# Altium schematic sheet Power_supply.SchDoc
size A; SheetNumber: 4; SheetTotal: 10
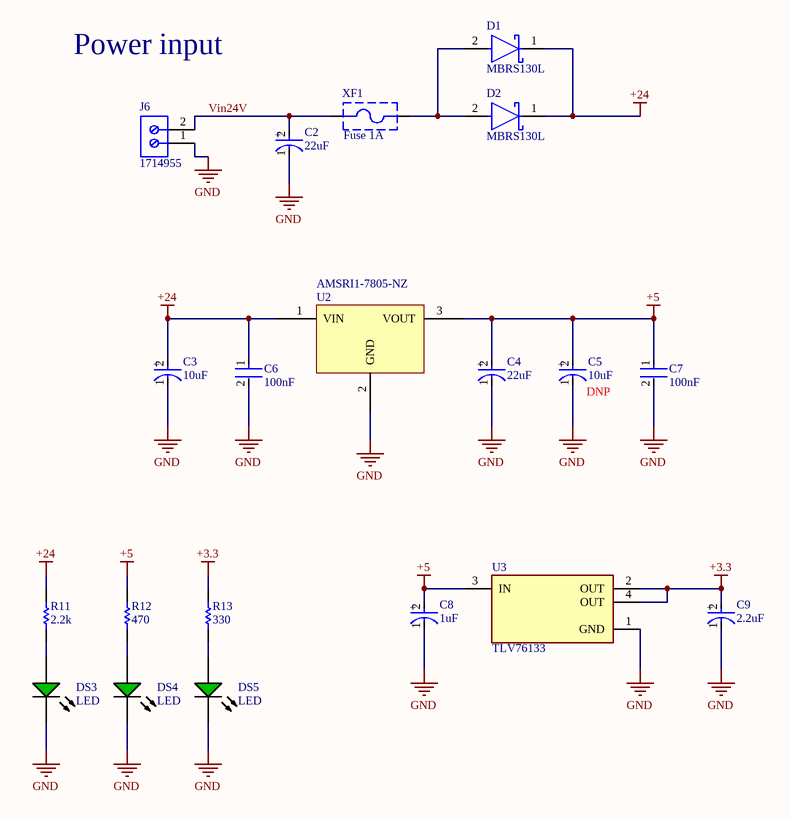
[diagram p0: Power_supply.SchDoc]

## Parts
C2  22uF  [FP-FCE-MFG]
C3  10uF  [FP-FKD-MFG]
C4  22uF  [FP-FCE-MFG]
C5  10uF  [FP-FKD-MFG]
C6  100nF  [FP-0805-L_2_01_0_2-W_1_25-IPC_B]
C7  100nF  [FP-0805-L_2_01_0_2-W_1_25-IPC_B]
C8  1uF  [FP-FKD-MFG]
C9  2.2uF  [FP-FKD-MFG]
D1  MBRS130L  [FP-403AF-MFG]
D2  MBRS130L  [FP-403AF-MFG]
DS3  LED  [AVAG-HSMX-C170_V]
DS4  LED  [AVAG-HSMX-C170_V]
DS5  LED  [AVAG-HSMX-C170_V]
J6  1714955  [PHOE-1714955_V]
R11  2.2k  [RESC2013X50X30LL20T20]
R12  470  [RESC2013X50X30LL20T20]
R13  330  [RESC2013X50X30LL20T20]
U2  AMSRI1-7805-NZ  [SIP750W46P254L1400H1010Q3]
U3  TLV76133  [FP-DCY0004A-MFG]
XF1  Fuse 1A  [696106003002]

## Nets
+3.3: C9.2(A) R13.2 U3.2(OUT) U3.4(OUT)
+5: C4.2(A) C5.2(A) C7.1 C8.2(A) R12.2 U2.3(VOUT) U3.3(IN)
+24: C3.2(A) C6.1 D1.1(C) D2.1(C) R11.2 U2.1(VIN)
GND: C2.1(C) C3.1(C) C4.1(C) C5.1(C) C6.2 C7.2 C8.1(C) C9.1(C) DS3.2(K) DS4.2(K) DS5.2(K) J6.1 U2.2(GND) U3.1(GND)
Vin24V: C2.2(A) J6.2 XF1.1
NetD1_2: D1.2(A) D2.2(A) XF1.2
NetDS3_1: DS3.1(A) R11.1
NetDS4_1: DS4.1(A) R12.1
NetDS5_1: DS5.1(A) R13.1

## Notes on the sheet
- Power input
- (near C5) DNP
- (in symbol CMP-2000-06207-2) +
- (in symbol CMP-05427-002128-1) +

## Library data of the parts
C2 C4 = CMP-05427-002128-1: CAP ALUM 22UF 20% 50V SMD; Ripple Current: 120mA; Material: Aluminium; ESR (Equivalent Series Resistance): 700mR; Polarity: Polar; Lead Length: 3.4mm; Leakage Current: 3uA; Life (Hours): 1000Hour; Diameter: 8mm; RoHS Compliant: Yes; Voltage Rating: 50V; Reach SVHC Compliant: Yes; Series: FC; Capacitance: 22uF; Ripple Current (AC): 120mA; Mount: Surface Mount; Min Operating Temperature: -40°C; Max Operating Temperature: 105°C; Radiation Hardening: No; Contact Plating: Tin; Impedance: 700mR; Construction: Cylindrical; Height - Seated (Max): 0.244inch; Packaging: Tape and Reel; Dielectric Material: Aluminium; Voltage: 50V; Voltage Rating (DC): 50V; Height: 6.2mm; Package Quantity: 1000; Length: 6.5mm; Lead Pitch: 2.2mm; Width: 8.3mm; Termination: SMD/SMT; Case/Package: Radial; Tolerance: 20%; Number of Pins: 2; Lead Free: Lead Free
C3 C5 C8 C9 = CMP-2000-06207-2: CAP ALUM 10UF 20% 50V SMD; Impedance: 880mR; Ripple Current: 165mA; Polarity: Polar; Leakage Current: 3uA; Lead Diameter: 0.65mm; Life (Hours): 2000Hour; REACH SVHC: No SVHC; Series: FK; Max Operating Temperature: 105°C; Radiation Hardening: No; Size: 5.8mm; Ripple Current (AC): 165mA; Lead Free: Lead Free; Voltage: 50V; Contact Plating: Tin; Case/Package: Radial; RoHS Compliant: Yes; Voltage Rating: 50V; Height - Seated (Max): 0.24inch; Package Quantity: 1000; Termination: SMD/SMT; Number of Pins: 2; Mount: Surface Mount; Packaging: Tape and Reel; Length: 5.8mm; Width: 7.8mm; Min Operating Temperature: -55°C; Height: 5.8mm; ESR (Equivalent Series Resistance): 880mR; Capacitance: 10uF; Diameter: 6.3mm; Voltage Rating (DC): 50V; Construction: Cylindrical; Tolerance: 20%; Lead Pitch: 1.8mm
C6 C7 = CMP-2007-04174-2: General Purpose Ceramic Capacitor, 0805, 10nF, 10%, X7R, 15%, 100V; Packaging: Tape and Reel; Min Operating Temperature: -55°C; Dielectric Material: Ceramic; Height: 1.4mm; Voltage Rating: 100V; Termination: SMD/SMT; Case Code (Imperial): 0805; Case Code (Metric): 2012; Case/Package: 0805; Construction: Flat; Radiation Hardening: No; Series: -; Dielectric: X7R; Package Quantity: 2000; Mount: Surface Mount; Capacitance: 100nF; Contact Plating: Tin; Voltage: 100V; Lead Free: Lead Free; Depth: 1.25mm; RoHS Compliant: Yes; Number of Pins: 2; Max Operating Temperature: 125°C; Length: 2.01mm; Voltage Rating (DC): 100V; Thickness: 0.055inch; REACH SVHC: No SVHC; Width: 0.049inch; Tolerance: 10%
D1 D2 = CMP-00278-20916186-1: MBRS130L Rectifier Diode, Schottky, 1 Phase, 1 Element, 2A, 30V V(RRM), Silicon, DO-214AA; Manufacturer Lifecycle Status: OBSOLETE; Output Current: 1A; Forward Voltage: 445mV; Peak Reverse Current: 1mA; Max Surge Current: 40A; Polarity: Standard; Element Configuration: Single; Max Junction Temperature (Tj): 125°C; Lead Free: Lead Free; Packaging: Cut Tape; Mount: Surface Mount; Max Repetitive Reverse Voltage (Vrrm): 30V; Forward Current: 2A; Length: 4.75mm; Weight: 180mg; Radiation Hardening: No; Max Operating Temperature: 125°C; Schedule B: 8541100080; Peak Non-Repetitive Surge Current: 40A; Height: 2.45mm; Case/Package: SMB; Min Operating Temperature: -65°C; Average Rectified Current: 2A; Lifecycle Status: Obsolete; REACH SVHC: No SVHC; Voltage Rating (DC): 30V; Max Forward Surge Current (Ifsm): 40A; NexarPartId: 20916186; Max Reverse Leakage Current: 1mA; Number of Pins: 2; Width: 3.95mm; RoHS: Compliant; Max Reverse Voltage (DC): 30V; Current Rating: 1A
DS3-DS5 = CMP-2000-05062-1: Chip LED, Green, 2.2 V, -40 to 85 degC, 2-Pin SMD, Pb-Free, Tape and Reel; Manufacturer: Avago; No. of Pins: 2; Peak Wavelength: 570nm; SVHC: NoSVHC(16-Jun-2014); Dominant Wavelength: 572nm; Forward Current If: 20mA; Viewing Angle: 170deg; Lens Shape: Rectangular; PIV Max: 5V; External Width: 1.25mm; LED Type: Standard; External Depth: 0.8mm; Opto Mounting Orientation: Top; Luminous Intensity: 15mcd; Luminous Intensity Min: 4mcd; Forward Voltage VF Max: 2.6V; External Length / Height: 2mm; Bulb Size: 1.25mmx1.4mm; Light Area Height: 1mm; Voltage Vf Typ: 2.2V; Operating Temperature Max: 85degC; Datasheet Version: Oct-08; MSL: MSL2A-4weeks; Peak Forward Current: 20mA; Package Description: 2-Pin Surface Mount Device, Body 2 x 1.25 mm, Height 0.8 mm; Datasheet URL: https://datasheet.ciiva.com/29280/180495-da-01-en-chip-led-hsmg-c170-gelb-gruen-29280971.pdf; Storage Temperature Min: -40degC; LED Colour: Green; Wavelength Typ: 570nm; Mounting Type: SMD; Forward Current If Max: 20mA; Dominant Wavelength Typ: 572nm; LED Mounting: SMD; Operating Temperature Range: -30degCto+85degC; Operating Temperature Min: -30degC; Manufacturer URL: http://www.avagotech.com/; Packaging: CutTape; Luminous Intensity Typ: 15mcd; Package Reference: HSMX-C170; Storage Temperature Max: 85degC; Opto Case Style: SMD; Forward Voltage: 2.2V
J6 = CMP-2000-05797-1: PC Terminal Block, Pitch 6.35 mm, 1 x 2 Position, Height 21.5 mm, Tail Lenght 5.1 mm, RoHS, Bulk; Manufacturer: Phoenix Contact; Package Description: PC Terminal Block, Pitch 6.35 mm, 1 x 2 Position, Height 21.5 mm, Tail Lenght 5.1 mm; Datasheet URL: http://media.digikey.com/pdf/Data%20Sheets/Phoenix%20Contact%20PDFs/1714955.pdf; Package Reference: 1714955; Manufacturer URL: http://www.phoenixcontact.com/; Datasheet Version: 02/2010; Mounting Technology: ThroughHole
R11-R13 = CMP-2001-04896-1: Manufacturer: Vishay Dale; Part Number: CRCW08050000Z0EA
U2 = AMSRI1-7805-NZ: AMSRI1-7805-NZ, 5V / 1A DC output converter
U3 = CMP-00370-134324849-1: TLV76133 1-A 16-V high-PSRR linear voltage regulator 4-SOT-223 -40 to 125; Manufacturer Lifecycle Status: ACTIVE; Number of Channels: 1; Min Supply Voltage: 6.5V; Nominal Supply Current: 65µA; Dropout Voltage: 900mV; Accuracy: 1%; Max Supply Voltage: 16V; Max Junction Temperature (Tj): 125°C; Output Current: 1A; Output Voltage: 5V; Width: 3.5mm; Length: 6.5mm; NexarPartId: 134324849; Max Operating Temperature: 125°C; Thickness: 1.6mm; Min Operating Temperature: -40°C; Case/Package: SOT-223; Height: 1.8mm; Lifecycle Status: Production; Number of Pins: 4; Number of Outputs: 1
XF1 = CMP-1502-00235-2: NexarPartId: 56808805; Fuse Current: 10A; Voltage Rating (AC): 250V; RoHS: Non-Compliant; Min Operating Temperature: -30°C; Height: 11.6mm; Packaging: Box; Mount: Through Hole; REACH SVHC: Unknown; Max Operating Temperature: 120°C